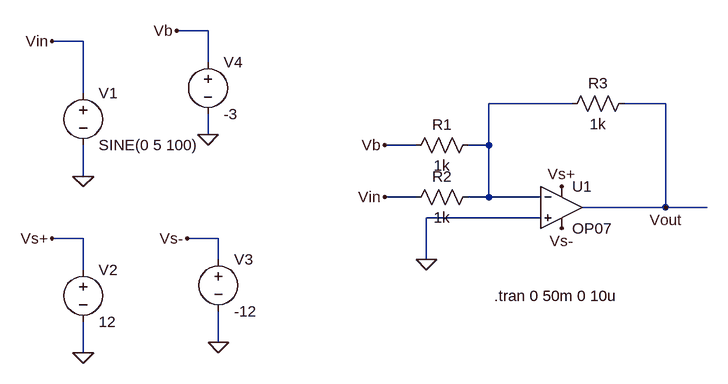
[diagram p0: schematic Task 4.asc]
Task 4.asc, the LTspice schematic file:
Version 4
SHEET 1 880 680
WIRE 80 -400 32 -400
WIRE -112 -384 -160 -384
WIRE 80 -352 80 -400
WIRE -112 -304 -112 -384
WIRE 640 -288 512 -288
WIRE 784 -288 720 -288
WIRE 80 -240 80 -272
WIRE 400 -224 352 -224
WIRE 512 -224 512 -288
WIRE 512 -224 480 -224
WIRE -112 -176 -112 -224
WIRE 400 -144 352 -144
WIRE 512 -144 512 -224
WIRE 512 -144 480 -144
WIRE 592 -144 512 -144
WIRE 784 -128 784 -288
WIRE 784 -128 656 -128
WIRE 848 -128 784 -128
WIRE 592 -112 416 -112
WIRE -112 -80 -160 -80
WIRE 96 -80 48 -80
WIRE 96 -48 96 -80
WIRE 416 -48 416 -112
WIRE -112 -32 -112 -80
WIRE 96 80 96 32
WIRE -112 96 -112 48
FLAG -112 -176 0
FLAG 80 -240 0
FLAG -112 96 0
FLAG 96 80 0
FLAG 416 -48 0
FLAG -160 -384 Vin
FLAG 352 -144 Vin
FLAG -160 -80 Vs+
FLAG 48 -80 Vs-
FLAG 32 -400 Vb
FLAG 352 -224 Vb
FLAG 624 -160 Vs+
FLAG 624 -96 Vs-
FLAG 784 -128 Vout
SYMBOL voltage -112 -320 R0
WINDOW 123 0 0 Left 0
WINDOW 39 0 0 Left 0
SYMATTR InstName V1
SYMATTR Value SINE(0 5 100)
SYMBOL voltage 80 -368 R0
WINDOW 123 0 0 Left 0
WINDOW 39 0 0 Left 0
SYMATTR InstName V4
SYMATTR Value -3
SYMBOL voltage -112 -48 R0
SYMATTR InstName V2
SYMATTR Value 12
SYMBOL voltage 96 -64 R0
SYMATTR InstName V3
SYMATTR Value -12
SYMBOL OpAmps\\OP07 624 -192 R0
SYMATTR InstName U1
SYMBOL res 496 -240 R90
WINDOW 0 0 56 VBottom 2
WINDOW 3 32 56 VTop 2
SYMATTR InstName R1
SYMATTR Value 1k
SYMBOL res 496 -160 R90
WINDOW 0 0 56 VBottom 2
WINDOW 3 32 56 VTop 2
SYMATTR InstName R2
SYMATTR Value 1k
SYMBOL res 736 -304 R90
WINDOW 0 0 56 VBottom 2
WINDOW 3 32 56 VTop 2
SYMATTR InstName R3
SYMATTR Value 1k
TEXT 520 8 Left 2 !.tran 0 50m 0 10u

The netlist it stands for:
* Task 4.asc
V1 Vin 0 SINE(0 5 100)
V4 Vb 0 -3
V2 Vs+ 0 12
V3 Vs- 0 -12
XU1 0 N001 Vs+ Vs- Vout LT1001  ; OP07, pins In+ In- V+ V- OUT
R1 N001 Vb 1k
R2 N001 Vin 1k
R3 Vout N001 1k
.tran 0 50m 0 10u
.lib LTC.lib
.backanno
.end